# EAGLE design FM RECEIVER (EAGLE 9.5.0)
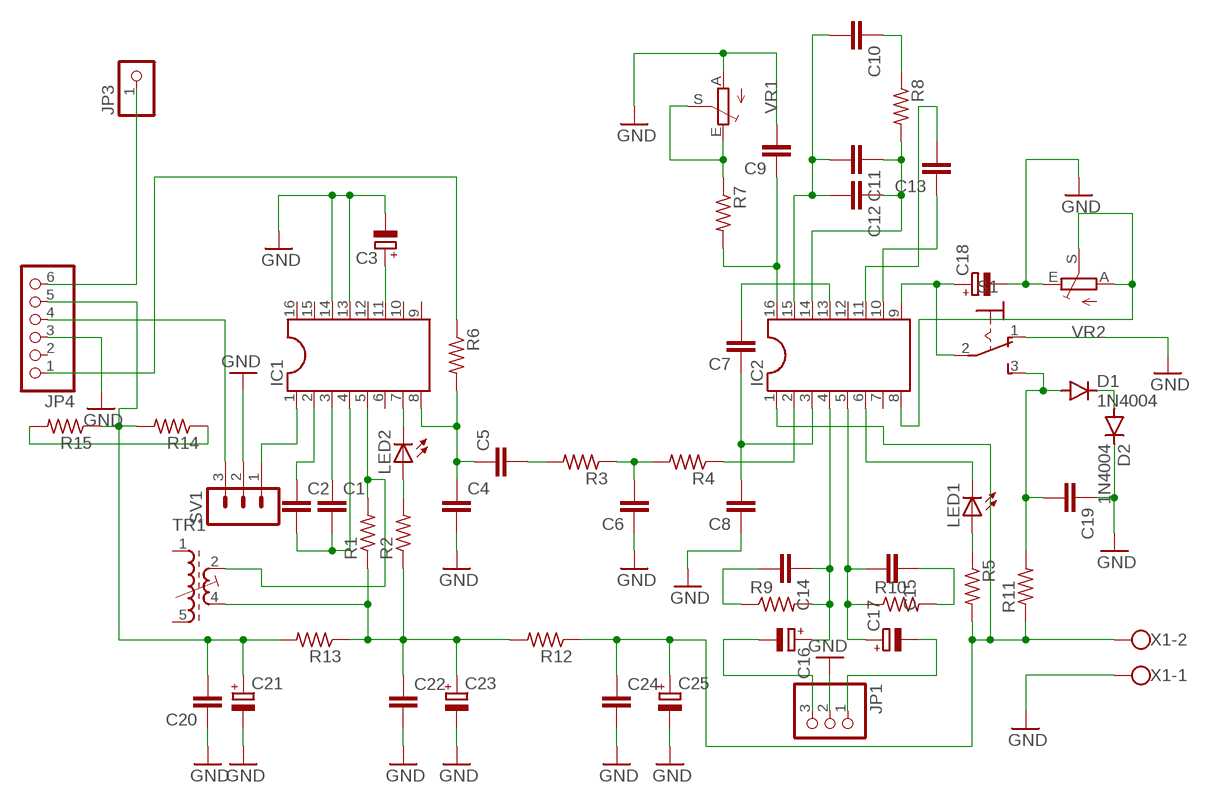
[diagram p0: schematic, sheet 1]

## Parts
C1  C-EU050-025X075  [C050-025X075]
C2  C-EU050-025X075  [C050-025X075]
C3  CPOL-EUE2,5-6E  [E2,5-6E]
C4  C-EU050-025X075  [C050-025X075]
C5  C-EU050-025X075  [C050-025X075]
C6  C-EU050-025X075  [C050-025X075]
C7  C-EU050-025X075  [C050-025X075]
C8  C-EU050-025X075  [C050-025X075]
C9  C-EU050-025X075  [C050-025X075]
C10  C-EU050-025X075  [C050-025X075]
C11  C-EU050-025X075  [C050-025X075]
C12  C-EU050-025X075  [C050-025X075]
C13  C-EU050-025X075  [C050-025X075]
C14  C-EU050-025X075  [C050-025X075]
C15  C-EU050-025X075  [C050-025X075]
C16  CPOL-EUE2,5-6E  [E2,5-6E]
C17  CPOL-EUE2,5-6E  [E2,5-6E]
C18  CPOL-EUE2,5-6E  [E2,5-6E]
C19  C-EU050-025X075  [C050-025X075]
C20  C-EU050-025X075  [C050-025X075]
C21  CPOL-EUE2,5-6E  [E2,5-6E]
C22  C-EU050-025X075  [C050-025X075]
C23  CPOL-EUE2,5-6E  [E2,5-6E]
C24  C-EU050-025X075  [C050-025X075]
C25  CPOL-EUE2,5-6E  [E2,5-6E]
D1  1N4004  [DO41-10]
D2  1N4004  [DO41-10]
IC1  DIL16  [DIL16]
IC2  DIL16  [DIL16]
JP1  PINHD-1X3  [1X03]
JP3  PINHD-1X1  [1X01]
JP4  PINHD-1X6  [1X06]
LED1  LED3MM  [LED3MM]
LED2  LED3MM  [LED3MM]
R1  R-US_0207/10  [0207/10]
R2  R-US_0207/10  [0207/10]
R3  R-US_0207/10  [0207/10]
R4  R-US_0207/10  [0207/10]
R5  R-US_0207/10  [0207/10]
R6  R-US_0207/10  [0207/10]
R7  R-US_0207/10  [0207/10]
R8  R-US_0207/10  [0207/10]
R9  R-US_0207/10  [0207/10]
R10  R-US_0207/10  [0207/10]
R11  R-US_0207/10  [0207/10]
R12  R-US_0207/10  [0207/10]
R13  R-US_0207/10  [0207/10]
R14  R-US_0207/10  [0207/10]
R15  R-US_0207/10  [0207/10]
S1  320-916  [320-916]
SV1  MA03-1  [MA03-1]
TR1  71-4-1542  [71-5]
VR1  TRIM_EU-CA6V  [CA6V]
VR2  TRIM_EU-CA6V  [CA6V]
X1  W237-102  [W237-102]

## Nets
GND: C3.- C4.2 C6.1 C8.1 C9.2 C18.- C19.1 C20.1 C21.- C22.2 C23.- C24.2 C25.- D2.C IC1.13 IC1.14 JP1.2 JP4.3 S1.1(O) SV1.2 VR1.A VR2.E X1.1
N$1: IC1.7 LED2.K(C)
N$2: LED2.A R2.2
N$3: C1.1 IC1.3
N$4: C2.1 IC1.2
N$5: C1.2 C2.2 IC1.4
N$6: IC1.5 R1.2 TR1.2(A2)
N$7: JP4.4 SV1.3
N$8: C15.1 R10.2
N$9: C20.2 C21.+ JP4.5 R13.2 R14.2 R15.1
N$10: C4.1 C5.1 IC1.8 R6.2
N$11: C14.2 R9.1
N$12: C5.2 R3.2
N$13: C6.2 R3.1 R4.2
N$14: IC2.2 R4.1
N$15: C14.1 C16.+ IC2.4 R9.2
N$16: C7.1 C8.2 IC2.3
N$17: IC1.1 SV1.1
N$18: C15.2 C17.+ IC2.5 R10.1
N$19: C24.1 C25.+ IC2.1 R5.2 R11.1 R12.1 X1.2
N$20: D1.C D2.A
N$21: C22.1 C23.+ R1.1 R2.1 R12.2 R13.1 TR1.4(E2)
N$22: C19.2 D1.A R11.2 S1.3(S)
N$23: IC2.6 LED1.K(C)
N$24: LED1.A R5.1
N$25: C11.1 C12.1 IC2.14 R8.2
N$27: C18.+ IC2.9 S1.2(P)
N$29: IC2.8 VR2.A VR2.S
N$30: C13.2 IC2.11
N$31: C13.1 IC2.10
N$32: C16.- JP1.3
N$33: C10.2 C11.2 C12.2 IC2.15
N$34: C17.- JP1.1
N$35: C10.1 R8.1
N$36: C9.1 IC2.16 R7.2
N$37: C3.+ IC1.11
N$38: R7.1 VR1.E VR1.S
N$39: JP3.1 JP4.6
N$40: JP4.1 R6.1
N$41: R14.1 R15.2
N$43: C7.2 IC2.13
Unconnected: IC1.6 IC1.9 IC1.10 IC1.12 IC1.15 IC1.16 IC2.7 IC2.12 JP4.2 TR1.1(A1) TR1.5(E1) TR1.S1 TR1.S2

## Library data of the parts
C1 C2 C4-C15 C19 C20 C22 C24 = rcl:C-EU: CAPACITOR, European symbol; SPICEPREFIX: C
C3 C16-C18 C21 C23 C25 = rcl:CPOL-EU: POLARIZED CAPACITOR, European symbol; SPICEPREFIX: C
D1 D2 = diode:1N4004: DIODE general purpose rectifier, 1 A
IC1 IC2 = ic-package:DIL16: Dual In Line / Socket
JP1 = pinhead:PINHD-1X3: PIN HEADER
JP3 = pinhead:PINHD-1X1: PIN HEADER
JP4 = pinhead:PINHD-1X6: PIN HEADER
LED1 LED2 = adafruit:LED: LED OSRAM: - CHIPLED LG R971, LG N971, LY N971, LG Q971, LY Q971, LO R971, LY R971 LH N974, LH R974 LS Q976, LO Q976, LY Q976 LO Q996 - Hyper CHIPLED LW Q18S LB Q993, LB Q99A, LB R99A - SideLED LS A670, LO A670, LY A670, LG A670, LP A670 LB A673, LV A673, LT A673, LW A673 LH A674 LY A675 LS A676, LA A676, LO A676, LY A676, LW A676 LS A679, LY A679, LG A679 - Hyper Micro SIDELED® LS Y876, LA Y876, LO Y876, LY Y876 LT Y87S - SmartLED LW L88C, LW L88S LB L89C, LB L89S, LG L890 LS L89K, LO L89K, LY L89K LS L896, LA L896, LO L896, LY L896 - TOPLED LS T670, LO T670, LY T670, LG T670, LP T670 LSG T670, LSP T670, LSY T670, LOP T670, LYG T670 LG T671, LOG T671, LSG T671 LB T673, LV T673, LT T673, LW T673 LH T674 LS T676, LA T676, LO T676, LY T676, LB T676, LH T676, LSB T676, LW T676 LB T67C, LV T67C, LT T67C, LS T67K, LO T67K, LY T67K, LW E67C LS E67B, LA E67B, LO E67B, LY E67B, LB E67C, LV E67C, LT E67C LW T67C LS T679, LY T679, LG T679 LS T770, LO T770, LY T770, LG T770, LP T770 LB T773, LV T773, LT T773, LW T773 LH T774 LS E675, LA E675, LY E675, LS T675 LS T776, LA T776, LO T776, LY T776, LB T776 LHGB T686 LT T68C, LB T68C - Hyper Mini TOPLED® LB M676 - Mini TOPLED Santana® LG M470 LS M47K, LO M47K, LY M47K Source: http://www.osram.convergy.de/
R1-R15 = rcl:R-US_: RESISTOR, American symbol; SPICEPREFIX: R
S1 = switch:320-916: TOGGLE SWITCH distributor RS Components
SV1 = con-lstb:MA03-1: PIN HEADER; OC_FARNELL: unknown; OC_NEWARK: unknown
TR1 = inductor-neosid:71-4-: TRANSFORMER adjustable filter transformer; OC_FARNELL: unknown; OC_NEWARK: unknown
VR1 VR2 = pot:TRIM_EU-: POTENTIOMETER
X1 = con-wago-500:W237-102: WAGO SCREW CLAMP; MPN: 237-102; OC_FARNELL: unknown; OC_NEWARK: 70K9898

## Board
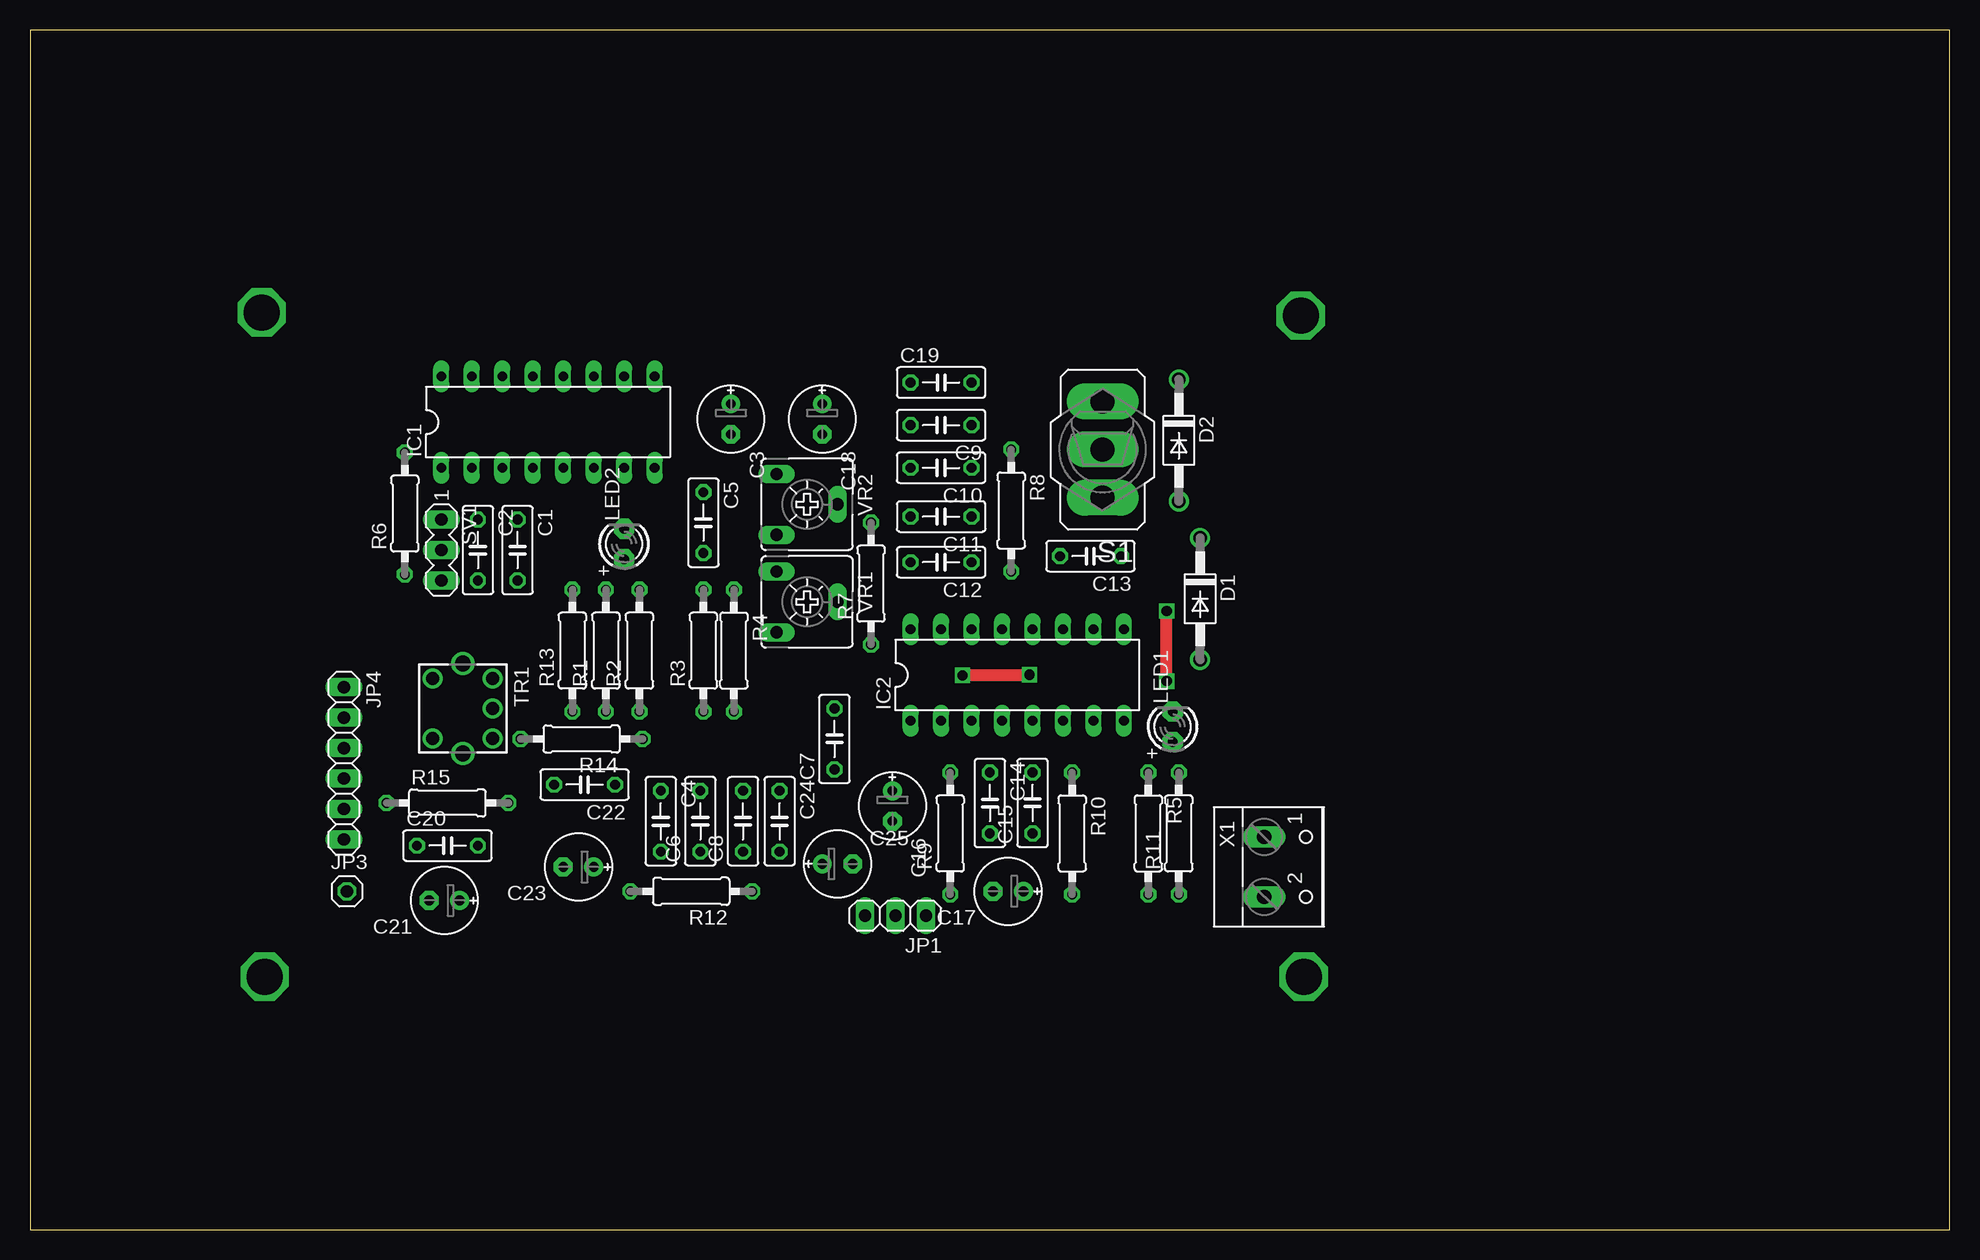
[diagram p1: board, top side]
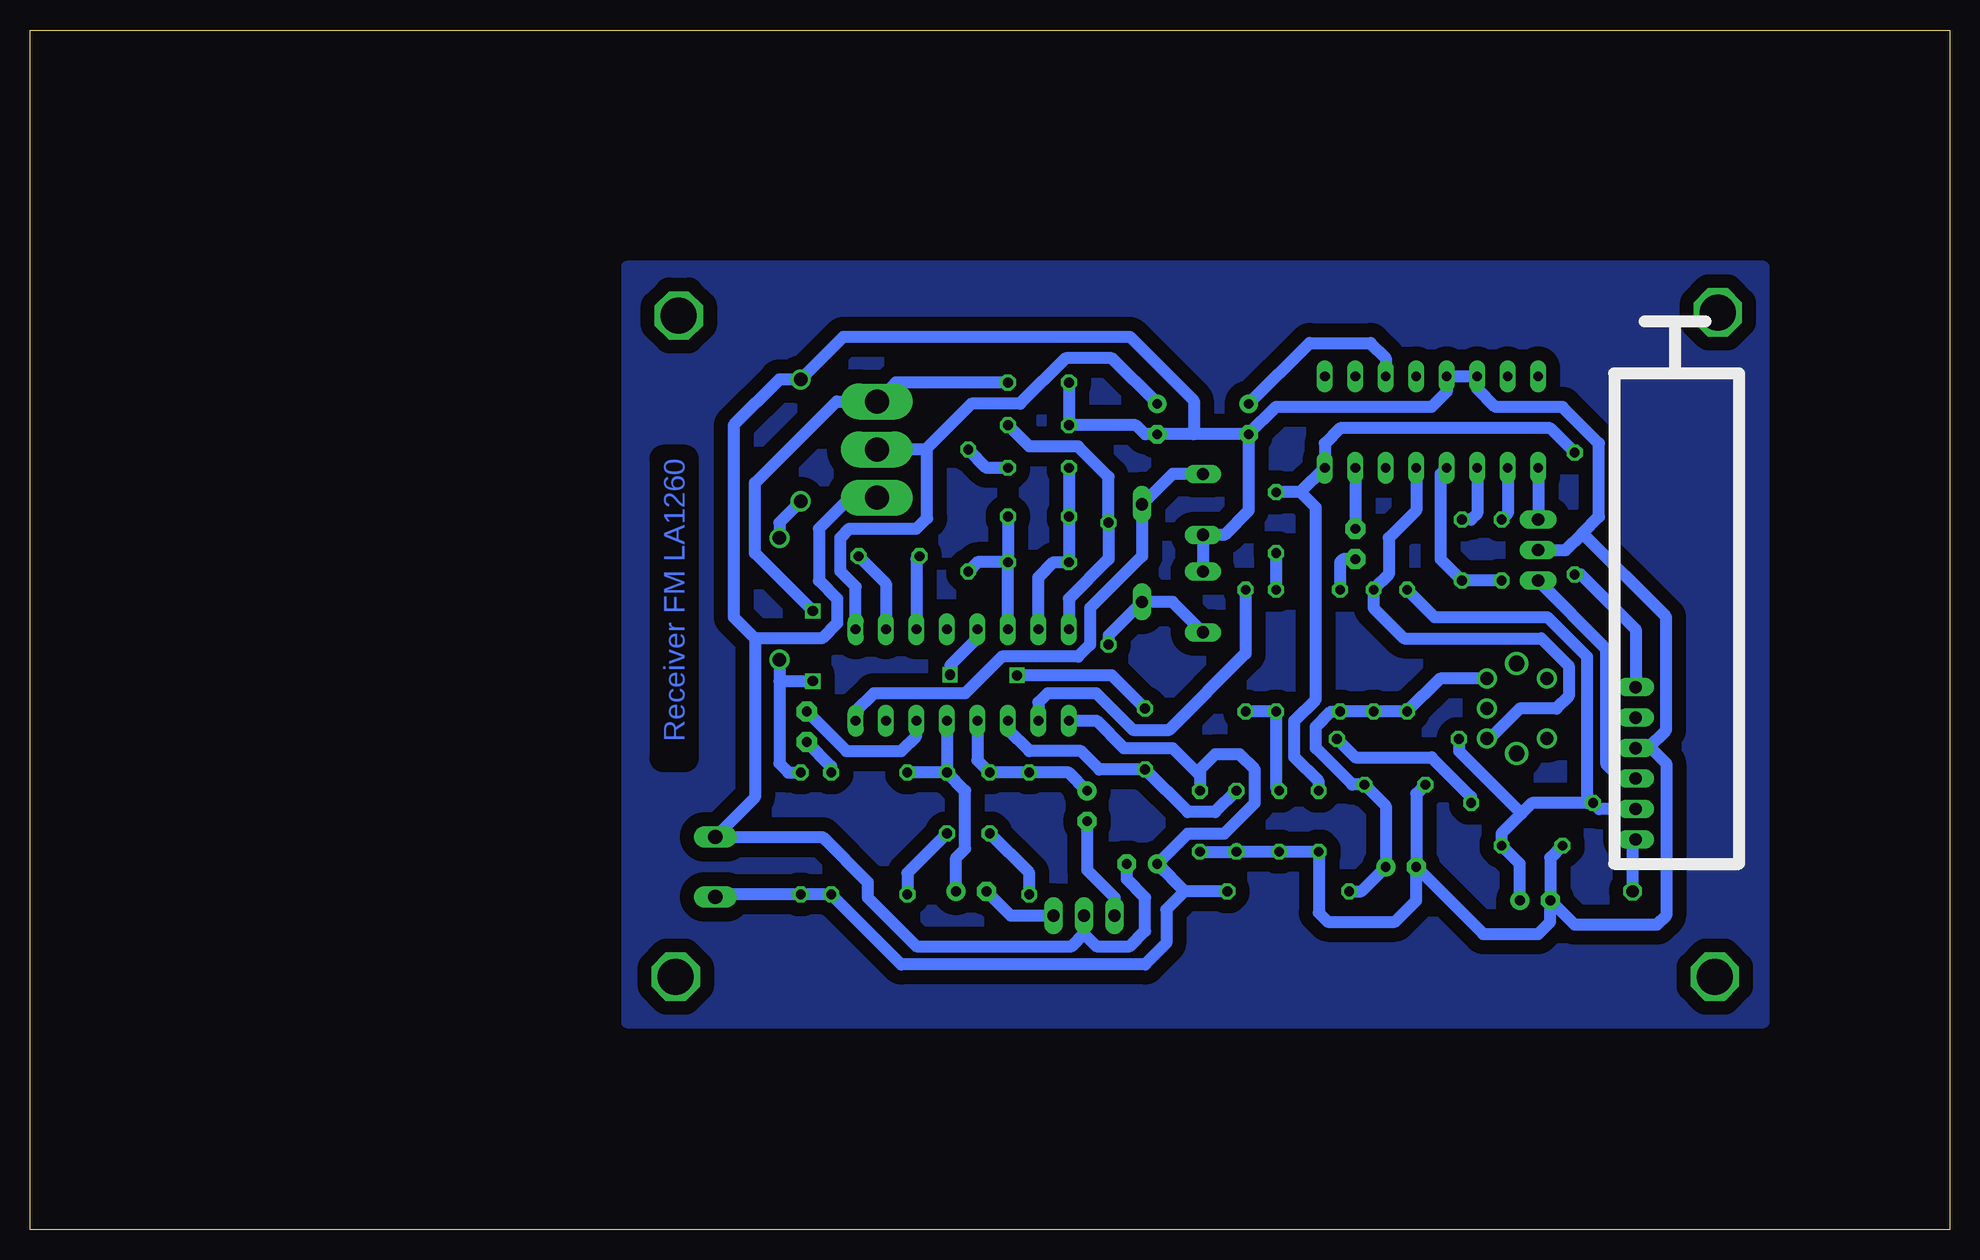
[diagram p2: board, bottom side, seen from below]

Size 160 x 100 mm. Coordinates in mm from the lower left corner, seen from the top.
Outline: 0,0 160,0 160,100 0,100 0,0
Copper layers (1*16): Top 0.035mm / dielectric 1.5mm / Bottom 0.035mm
Design rules "default *": minimum track width 6mil, minimum drill 0.35mm, track to track 46mil, track to pad 46mil, pad to pad 6mil, via to via 6mil, smd to smd 6mil, copper to edge 40mil, drill to drill 6mil, minimum pad ring 10mil, minimum via ring 8mil, stop-mask expansion 4mil, vias tented up to drill 0mil, thermal gap 10mil

### Footprints (pad centres in the part's own frame; a part is rotated, then mirrored left to right if it is on the bottom)
C050-025X075 = drill 0.813 octagon: 1 -2.54,0; 2 2.54,0
E2,5-6E = drill 0.813 pad 1.575: + -1.27,0 | drill 0.813 pad 1.575 octagon: - 1.27,0
DO41-10 = drill 1.118: A 5.08,0; C -5.08,0
DIL16 = drill 0.813 long: 1 -8.89,-3.81; 2 -6.35,-3.81; 3 -3.81,-3.81; 4 -1.27,-3.81; 5 1.27,-3.81; 6 3.81,-3.81; 7 6.35,-3.81; 8 8.89,-3.81; 9 8.89,3.81; 10 6.35,3.81; 11 3.81,3.81; 12 1.27,3.81; 13 -1.27,3.81; 14 -3.81,3.81; 15 -6.35,3.81; 16 -8.89,3.81
1X03 = drill 1.016 long: 1 -2.54,0; 2 0,0; 3 2.54,0
1X01 = drill 1.016 octagon: 1 0,0
1X06 = drill 1.016 long: 1 -6.35,0; 2 -3.81,0; 3 -1.27,0; 4 1.27,0; 5 3.81,0; 6 6.35,0
LED3MM = drill 0.813 pad 1.676 octagon: A -1.27,0; K 1.27,0
0207/10 = drill 0.813 octagon: 1 -5.08,0; 2 5.08,0
320-916 = drill 2.007 long: 1 0,4.013; 2 0,0; 3 0,-4.013
MA03-1 = drill 1.016 long: 1 -2.54,0; 2 0,0; 3 2.54,0
71-5 = drill 1.1: 1 2.5,-2.5; 2 2.5,2.5; 3 0,2.5; 4 -2.5,2.5; 5 -2.5,-2.5 | drill 1.3: S1 -3.75,0; S2 3.75,0
CA6V = drill 1.016 long: A -2.54,-2.54; E 2.54,-2.54; S 0,2.54
W237-102 = drill 1.194 long: 1 -2.5,-1.27; 2 2.5,-1.27

### Placement (x,y rotation side)
C1  40.64,56.64 270 top
C2  37.34,56.64 270 top
C3  58.42,67.56 270 top
C4  52.58,34.04 270 top
C5  56.13,58.93 270 top
C6  55.88,34.04 90 top
C7  67.06,40.89 90 top
C8  59.44,34.04 90 top
C9  75.95,67.06 180 top
C10  75.95,63.5 180 top
C11  75.95,59.44 180 top
C12  75.95,55.63 180 top
C13  88.39,56.13 180 top
C14  80.01,35.56 270 top
C15  83.57,35.56 90 top
C16  71.88,35.31 270 top
C17  81.53,28.19 180 top
C18  66.04,67.56 270 top
C19  75.95,70.61 0 top
C20  34.8,32 0 top
C21  34.54,27.43 180 top
C22  46.23,37.08 180 top
C23  45.72,30.23 180 top
C24  62.48,34.04 270 top
C25  67.31,30.48 0 top
D1  97.54,52.58 270 top
D2  95.76,65.79 270 top
IC1  43.18,67.31 0 top
IC2  82.3,46.23 0 top
JP1  72.14,26.16 180 top
JP3  26.42,28.19 0 top
JP4  26.16,38.86 270 top
LED1  95.25,41.91 90 top
LED2  49.53,57.15 90 top
R1  48.01,48.26 90 top
R2  50.8,48.26 90 top
R3  56.13,48.26 90 top
R4  58.67,48.26 270 top
R5  93.22,33.02 270 top
R6  31.24,59.69 90 top
R7  70.1,53.85 90 top
R8  81.79,59.94 270 top
R9  76.71,33.02 90 top
R10  86.87,33.02 270 top
R11  95.76,33.02 90 top
R12  55.12,28.19 180 top
R13  45.21,48.26 90 top
R14  45.97,40.89 180 top
R15  34.8,35.56 0 top
S1  89.41,65.02 180 top
SV1  34.29,56.64 270 top
TR1  36.07,43.43 270 top
VR1  64.77,52.32 270 top
VR2  64.77,60.45 270 top
X1  104.14,30.23 270 top

### Tracks (layer width: path | path; a pad name or v marks a point on that pad's centre or on a via)
GND
  Bottom 1: C22.2 44.45,36.32 C23.- | C20.1 33.27,30.99 C21.- | C8.1 C6.1 C4.2 52.58,26.42 51.82,25.65 46.23,25.65 44.45,27.43 C23.- | C23.- 38.86,24.64 34.29,24.64 33.27,25.65 C21.- | C25.- 68.58,29.21 67.06,27.69 67.06,24.89 68.33,23.62 71.12,23.62 72.14,24.64 | VR1.A VR2.E 60.45,57.91 58.42,59.94 C3.- | SV1.2 32,56.64 30.61,58.04 | 30.61,58.04 29.21,59.44 29.21,65.53 32.26,68.58 37.85,68.58 39.37,70.1 IC1.14 IC1.13 41.91,69.85 43.18,68.58 56.13,68.58 C3.- | C3.- 62.99,66.29 | 62.99,66.29 C18.- 67.06,66.29 67.82,67.06 C9.2 C19.1 | 91.73,61.01 S1.1 91.64,61.01 94.23,58.42 94.23,54.1 92.71,52.58 92.71,50.55 93.98,49.28 99.57,49.28 | 96.01,70.61 D2.C | JP1.2 72.14,24.64 | 59.44,31.75 C8.1 | 99.57,49.28 99.57,36.03 X1.1 93.94,32.73 90.17,28.96 90.17,27.69 86.11,23.62 73.15,23.62 72.14,24.64 | D2.C 97.54,70.87 101.35,67.06 101.35,51.05 99.57,49.28 | D2.C 92.2,74.42 68.33,74.42 62.99,69.09 62.99,66.29 | C24.2 C8.1 | C21.- 31.24,25.4 24.38,25.4 23.62,26.16 23.62,38.86 24.89,40.13 JP4.3 25.15,40.13 23.62,41.66 23.62,51.05 30.61,58.04
N$1
  Bottom 1: IC1.7 LED2.K
N$2
  Bottom 1: LED2.A 50.55,55.88 50.8,55.63 R2.2
N$3
  Bottom 1: IC1.3 39.37,59.69 39.88,59.18 C1.1
N$4
  Bottom 1: IC1.2 36.83,59.69 C2.1
N$5
  Bottom 1: IC1.4 42.42,62.99 42.42,55.88 C1.2 C2.2
N$6
  Bottom 1: IC1.5 44.45,59.94 46.74,57.66 46.74,54.61 R1.2 48.01,51.82 45.47,49.28 34.04,49.28 31.75,46.99 31.75,44.45 32.77,43.43 35.81,43.43 38.31,40.93 TR1.2
N$7
  Bottom 1: JP4.4 27.43,37.59 28.59,38.75 28.59,48.4 SV1.3
N$8
  Bottom 1: C15.1 86.87,29.72 R10.2
N$9
  Bottom 1: R15.1 34.8,35.56 35.69,34.67 | 35.69,34.67 37.34,33.02 C20.2 35.81,30.48 C21.+ | R13.2 42.93,51.05 33.53,51.05 30.23,47.75 30.23,35.56 R15.1 | R14.2 40.89,39.88 35.69,34.67 | JP4.5 29.21,35.05 R15.1
N$10
  Bottom 1: 54.1,61.47 IC1.8 52.07,65.53 50.8,66.8 33.27,66.8 R6.2 | 54.1,61.47 C5.1 | C4.1 52.58,37.34 54.61,39.37 54.61,42.42 52.83,44.2 52.83,60.2 54.1,61.47
N$11
  Bottom 1: R9.1 76.71,29.72 C14.2
N$12
  Bottom 1: C5.2 R3.2
N$13
  Bottom 1: R4.2 R3.1 56.13,36.83 C6.2
N$14
  Bottom 1: IC2.2 75.95,43.94 75.18,44.7 71.12,44.7 68.07,41.66 65.02,41.66 58.67,48.01 R4.1
N$15
  Bottom 1: C16.+ 73.41,38.1 R9.2 C14.1 81.03,39.12 IC2.4
N$16
  Bottom 1: IC2.3 78.49,41.66 76.71,39.88 72.39,39.88 70.87,38.35 C7.1 63.5,34.8 61.21,34.8 C8.2
N$17
  Bottom 1: IC1.1 SV1.1
N$18
  Bottom 1: IC2.5 C15.2 | C15.2 R10.1 | C15.2 82.04,36.58 82.04,31.75 82.8,30.99 C17.+
N$19
  Bottom 1: C25.+ 65.53,29.97 | C25.+ 63.75,28.19 | R12.1 63.75,28.19 | 63.75,28.19 65.28,26.67 65.28,23.88 67.06,22.1 87.38,22.1 R5.2 R11.1 103.38,27.94 103.63,27.69 102.91,27.69 X1.2 | 62.48,37.85 C24.1 | IC2.1 71.12,42.42 68.83,40.13 64.77,40.13 62.48,37.85 | C25.+ 63.5,33.02 60.45,33.02 57.91,35.56 57.91,38.35 59.18,39.62 61.21,39.62 62.48,38.35 62.48,37.85
N$20
  Bottom 1: D2.A 97.54,58.93 D1.C
N$21
  Bottom 1: TR1.4 42.46,45.93 R13.1 R1.1 R2.1 51.56,43.18 52.83,41.91 52.83,40.13 49.78,37.08 C22.1 46.99,35.31 C23.+ 49.02,28.19 R12.2
N$22  (via drill 0.85)
  Top 1: v94.74,45.72 v94.74,51.56
  Bottom 1: C19.2 87.83,70.61 S1.3 92.76,69.04 99.57,62.23 99.57,56.39 v94.74,51.56 | D1.A 97.54,45.72 | 97.54,45.72 97.54,38.86 96.77,38.1 R11.2 | 97.54,45.72 v94.74,45.72
N$23
  Bottom 1: IC2.6 86.11,41.15 87.38,39.88 91.95,39.88 LED1.K
N$24
  Bottom 1: R5.1 93.22,38.61 LED1.A
N$25
  Bottom 1: IC2.14 C12.1 | C11.1 C12.1 | C12.1 81.03,55.63 R8.2
N$26  (via drill 3)
  other vias: 19.3,76.45
N$27
  Bottom 1: C18.+ 69.85,72.64 73.66,72.64 77.47,68.83 81.53,68.83 85.22,65.15 | S1.2 85.34,65.02 85.22,65.15 | IC2.9 91.19,53.59 92.46,54.86 92.46,57.66 91.69,58.42 86.11,58.42 85.22,59.31 85.22,65.15
N$28  (via drill 3)
  other vias: 105.92,76.2
N$29
  Bottom 1: VR2.A 64.77,62.99 VR2.S 67.31,56.13 71.63,51.82 71.63,48.77 72.64,47.75 78.99,47.75 82.04,44.7 89.66,44.7 91.19,43.18 IC2.8
N$30
  Bottom 1: C13.2 86.11,55.88 IC2.11
N$31
  Bottom 1: C13.1 88.65,53.85 IC2.10
N$32
  Bottom 1: C16.- 71.88,29.97 69.6,27.69 JP1.3
N$33
  Bottom 1: IC2.15 75.95,54.36 74.68,55.63 C12.2 C11.2 C10.2
N$34
  Bottom 1: JP1.1 78.23,26.16 C17.-
N$35
  Bottom 1: C10.1 80.26,63.5 R8.1
N$36
  Bottom 1: IC2.16 73.41,52.58 70.1,55.88 R7.2 70.1,62.74 72.64,65.28 76.71,65.28 C9.1
N$37
  Bottom 1: C3.+ 53.34,73.91 48.26,73.91 46.99,72.64 IC1.11
N$38
  Bottom 1: 70.1,49.02 R7.1 70.1,49.53 VR1.S 64.77,52.32 VR1.E
N$39
  Bottom 1: JP4.6 26.42,32.26 JP3.1
N$40
  Bottom 1: R6.1 30.73,54.61 26.16,50.04 JP4.1
N$41
  Bottom 1: R15.2 39.88,36.07 43.18,39.37 49.53,39.37 R14.1
N$42  (via drill 3)
  other vias: 106.17,21.08
N$43  (via drill 0.85)
  Top 1: v83.31,46.26 83.25,46.2 v77.72,46.2
  Bottom 1: IC2.13 81.03,49.31 83.31,47.02 v83.31,46.26 | v77.72,46.2 77.69,46.23 69.85,46.23 C7.2
N$44  (via drill 3)
  other vias: 19.56,21.08
VV
  pour Bottom: 17.27,80.26 110.24,80.26 110.24,17.27 15.49,17.27 15.49,80.26

### Text on the board
Bottom: Receiver FM LA1260